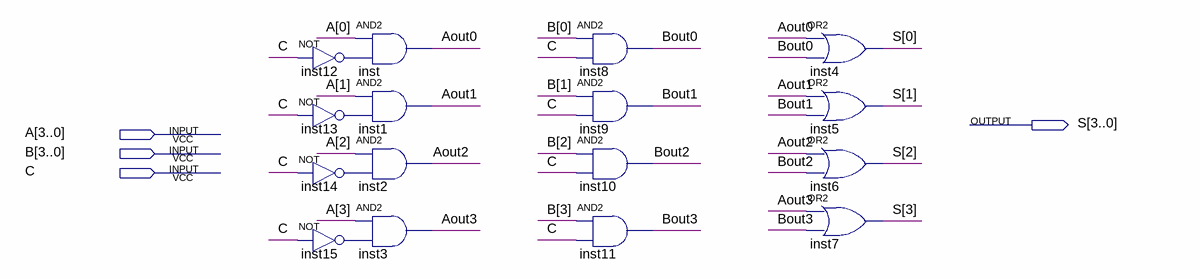
[diagram p0: schematic sheet]
// Quartus schematic MUX4_1.bdf as structural Verilog: 16 symbols, 4 pins
module MUX4_1 (
  input  [3:0] A,
  input  [3:0] B,
  input  C,
  output [3:0] S
);

  wire Aout0, Aout1, Aout2, Aout3, Bout0, Bout1, Bout2, Bout3, inst12_out, inst13_out, inst14_out, inst15_out;

  not inst12 (inst12_out, C);
  not inst13 (inst13_out, C);
  not inst14 (inst14_out, C);
  not inst15 (inst15_out, C);
  and inst (Aout0, A[0], inst12_out);
  and inst1 (Aout1, A[1], inst13_out);
  and inst2 (Aout2, A[2], inst14_out);
  and inst3 (Aout3, A[3], inst15_out);
  and inst8 (Bout0, B[0], C);
  and inst9 (Bout1, B[1], C);
  and inst10 (Bout2, B[2], C);
  and inst11 (Bout3, B[3], C);
  or inst4 (S[0], Aout0, Bout0);
  or inst5 (S[1], Aout1, Bout1);
  or inst6 (S[2], Aout2, Bout2);
  or inst7 (S[3], Aout3, Bout3);
endmodule
